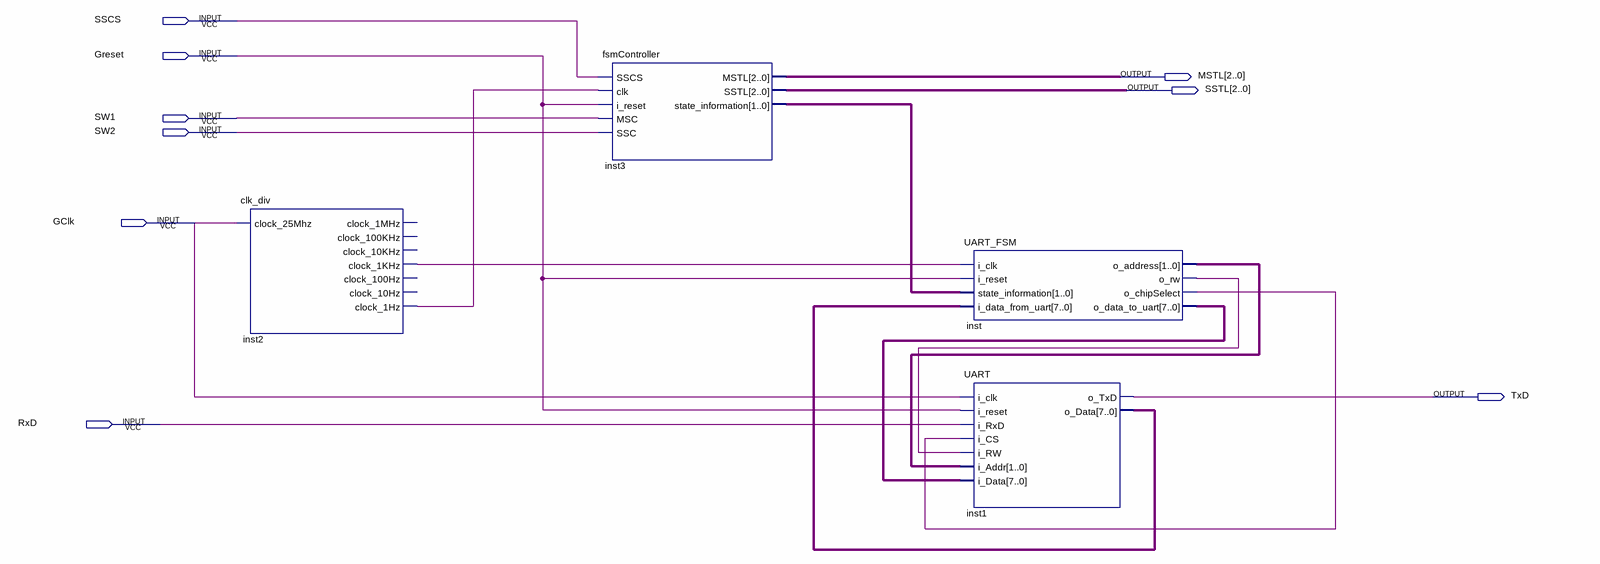
[diagram p0: schematic sheet]
// Quartus schematic Project.bdf as structural Verilog: 4 symbols, 9 pins
module Project (
  input  SSCS,
  input  Greset,
  input  SW1,
  input  SW2,
  input  GClk,
  input  RxD,
  output [2:0] MSTL,
  output [2:0] SSTL,
  output TxD
);

  wire inst2_clock_1hz, inst2_clock_1khz, inst_o_chipselect, inst_o_rw;
  wire [1:0] inst3_state_information, inst_o_address;
  wire [7:0] inst1_o_data, inst_o_data_to_uart;

  clk_div inst2 (
    .clock_25Mhz(GClk), .clock_1KHz(inst2_clock_1khz), .clock_1Hz(inst2_clock_1hz));  // open: clock_1MHz, clock_100KHz, clock_10KHz, clock_100Hz, clock_10Hz
  fsmController inst3 (
    .SSCS(SSCS), .clk(inst2_clock_1hz), .i_reset(Greset), .MSC(SW1), .SSC(SW2), .MSTL(MSTL), .SSTL(SSTL),
    .state_information(inst3_state_information));
  UART_FSM inst (
    .i_clk(inst2_clock_1khz), .i_reset(Greset), .state_information(inst3_state_information),
    .i_data_from_uart(inst1_o_data), .o_address(inst_o_address), .o_rw(inst_o_rw),
    .o_chipSelect(inst_o_chipselect), .o_data_to_uart(inst_o_data_to_uart));
  UART inst1 (
    .i_clk(GClk), .i_reset(Greset), .i_RxD(RxD), .i_CS(inst_o_chipselect), .i_RW(inst_o_rw),
    .i_Addr(inst_o_address), .i_Data(inst_o_data_to_uart), .o_TxD(TxD), .o_Data(inst1_o_data));
endmodule
